# EAGLE design TR_i3_6A_Module_v11 (EAGLE 9.6.2)

## Sheet 1 of 2
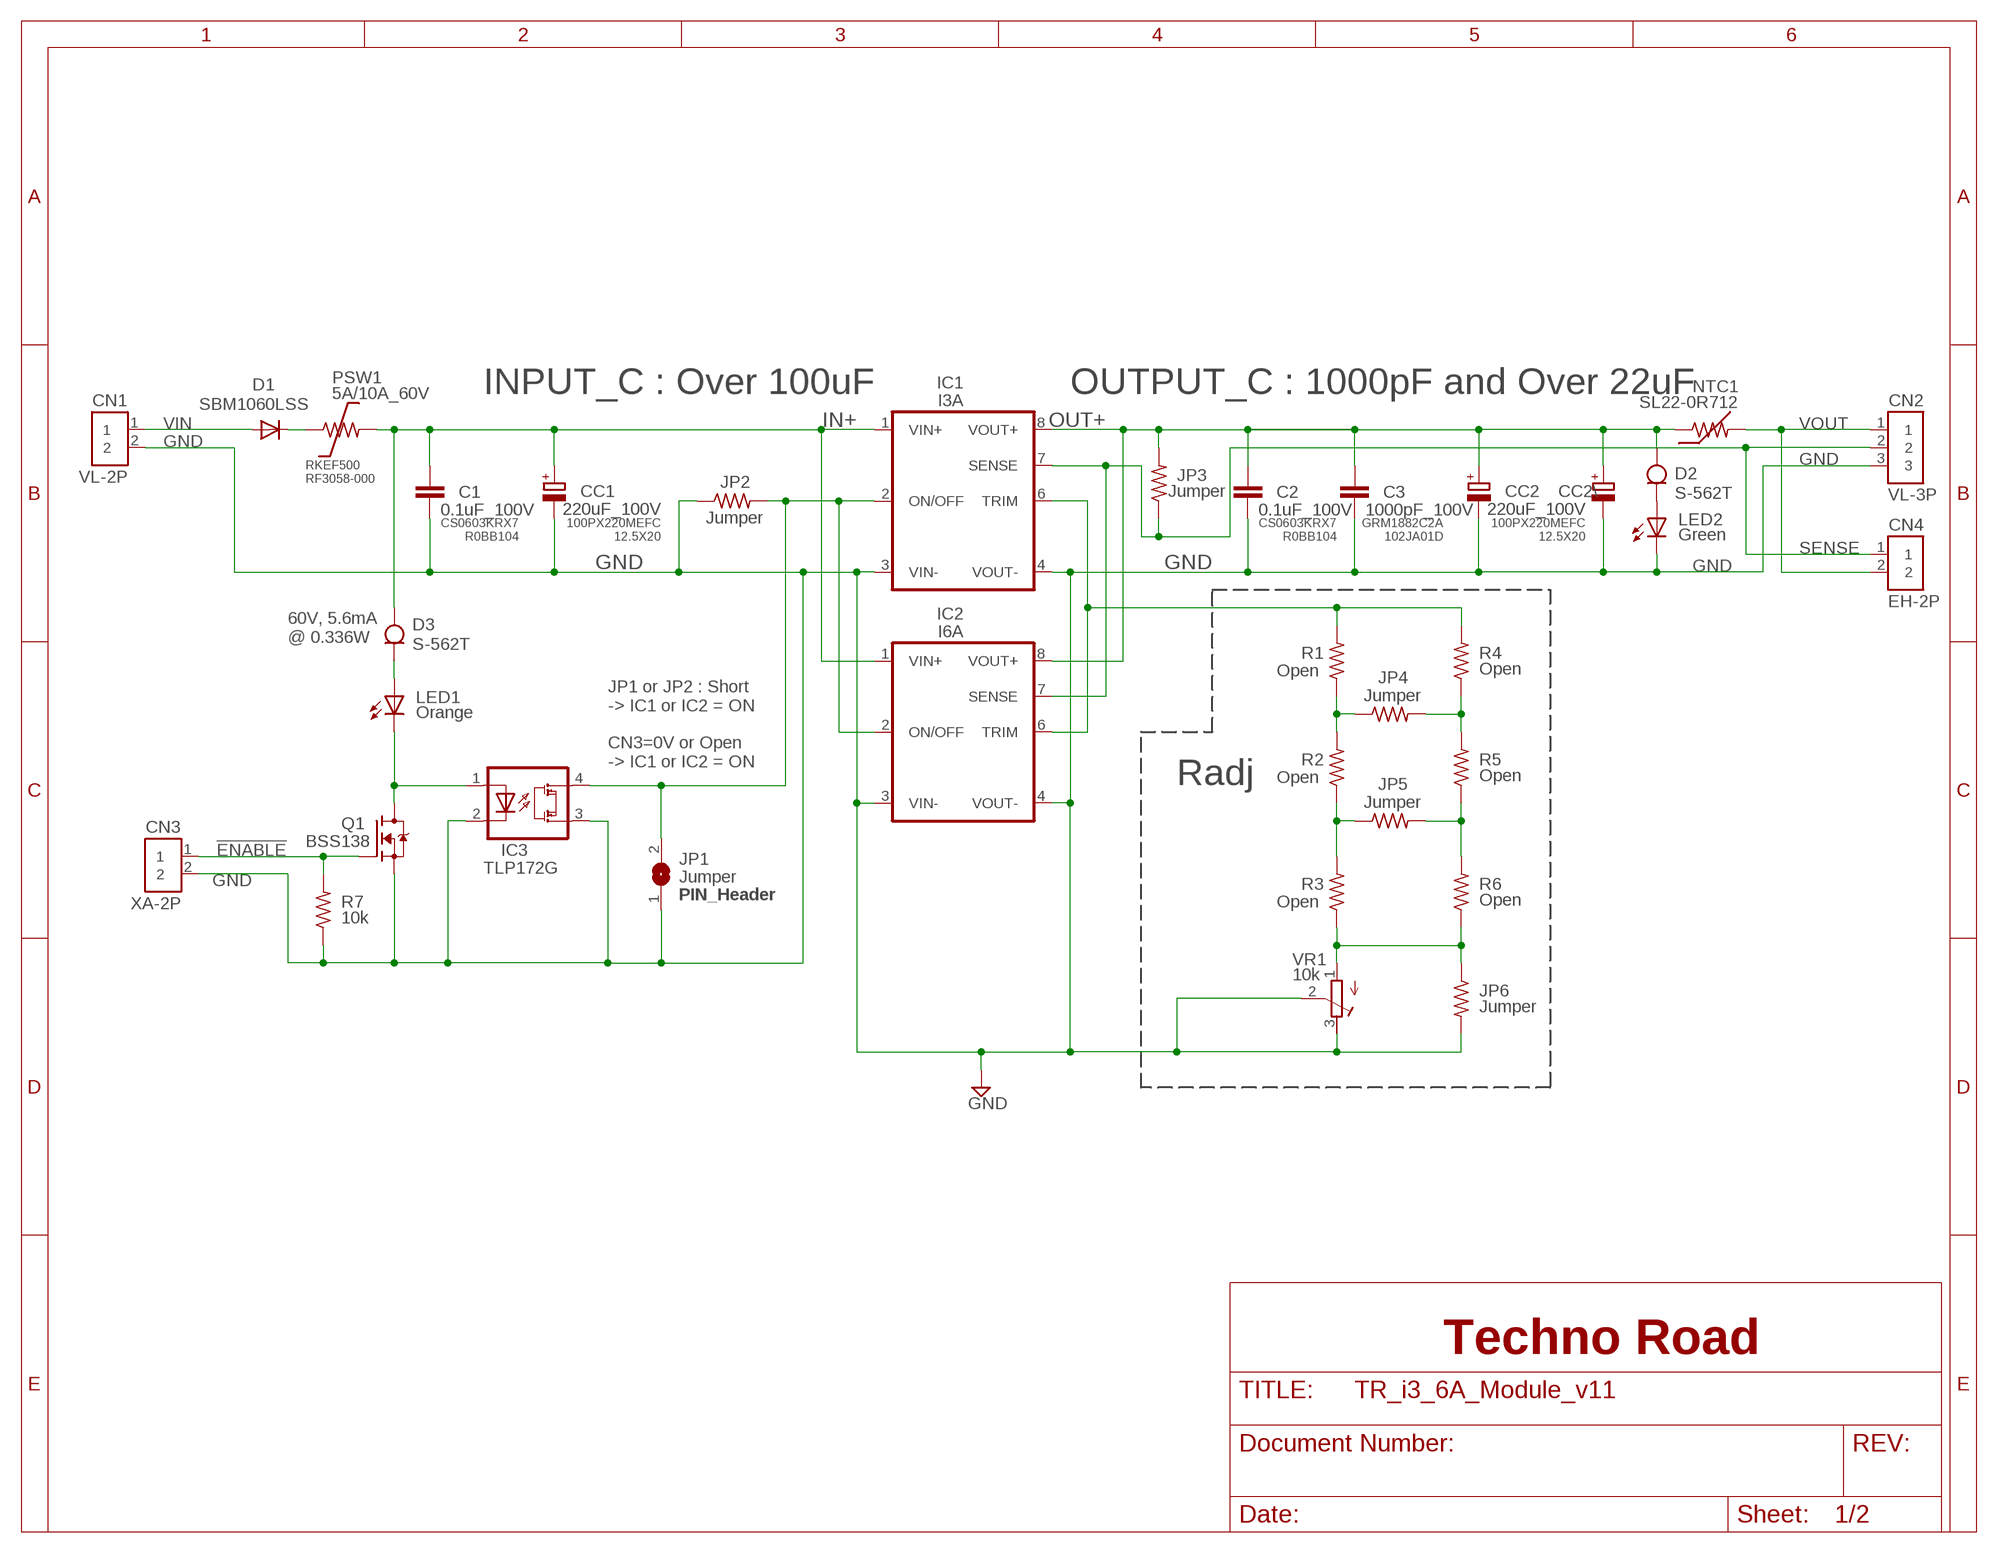
[diagram p0: schematic, sheet 1]

### Parts
C1  0.1uF_100V  C1608  [C1608]
C2  0.1uF_100V  C1608  [C1608]
C3  1000pF_100V  C1608  [C1608]
CC1  220uF_100V  CC0510  [CC0510]
CC2  220uF_100V  CC0510  [CC0510]
CC2\  CPOL-EUE7.5-16  [E7,5-16]
CN1  VL-2P  2PVL3  [VL3-2P]
CN2  VL-3P  3PVL3  [VL3-3P]
CN3  XA-2P  2PXA_NH  [XA-2P_NH]
CN4  EH-2P  2PEH  [EH-2P]
D1  SBM1060LSS  D12.7  [12.7MM]
D2  S-562T  CRDS-XXXT  [S-XXXT]
D3  S-562T  CRDS-XXXT  [S-XXXT]
IC1  I3A  I3A/I6A_SEREISI3A  [I3A_SERIES]
IC2  I6A  I3A/I6A_SEREISI6A  [I6A_SERIES]
IC3  TLP172G  TLP172  [11-5H1]
JP1  Jumper  JP1D  [JP1D_HOLE]
JP2  Jumper  R1608_LARGE_PAD  [R1608_LARGE_PAD]
JP3  Jumper  R1608_LARGE_PAD  [R1608_LARGE_PAD]
JP4  Jumper  R1608_LARGE_PAD  [R1608_LARGE_PAD]
JP5  Jumper  R1608_LARGE_PAD  [R1608_LARGE_PAD]
JP6  Jumper  R1608_LARGE_PAD  [R1608_LARGE_PAD]
LED1  Orange  LEDSML0603  [SML1608]
LED2  Green  LEDSML0603  [SML1608]
NTC1  SL22-0R712  NTCSL22  [SL22]
PSW1  5A/10A_60V  PSW10.16MM_4MM  [PSW-10.16MM_4MM]
Q1  BSS138  [SOT-23-3]
R1  Open  R1608_LARGE_PAD  [R1608_LARGE_PAD]
R2  Open  R1608_LARGE_PAD  [R1608_LARGE_PAD]
R3  Open  R1608_LARGE_PAD  [R1608_LARGE_PAD]
R4  Open  R1608_LARGE_PAD  [R1608_LARGE_PAD]
R5  Open  R1608_LARGE_PAD  [R1608_LARGE_PAD]
R6  Open  R1608_LARGE_PAD  [R1608_LARGE_PAD]
R7  10k  R1608_LARGE_PAD  [R1608_LARGE_PAD]
VR1  10k  R-TRIM3361P  [3361P]

### Nets
!ENABLE: CN3.1 Q1.1(G) R7.2
D_PSW: D1.2(C) PSW1.1
GND: C1.2 C2.2 C3.2 CC1.- CC2.- CC2\.- CN1.2 CN2.3 CN3.2 IC1.3(VIN-) IC1.4(VOUT-) IC2.3(VIN-) IC2.4(VOUT-) IC3.2(C1) IC3.3(DRN1) JP1.1 JP2.1 JP6.2 LED2.C Q1.2(S) R7.1 VR1.2(S) VR1.3(E)
IN+: C1.1 CC1.+ D3.A IC1.1(VIN+) IC2.1(VIN+) PSW1.2
N$1: JP6.1 R3.1 R6.1 VR1.1(A)
N$2: JP4.1 R1.1 R2.2
N$3: JP5.1 R2.1 R3.2
N$4: IC1.2(ON/OFF) IC2.2(ON/OFF) IC3.4(DRN2) JP1.2 JP2.2
N$5: D2.C LED2.A
N$6: D3.C LED1.A
N$7: IC1.6(TRIM) IC2.6(TRIM) R1.2 R4.2
N$8: JP4.2 R4.1 R5.2
N$9: JP5.2 R5.1 R6.2
N$10: IC3.1(A1) LED1.C Q1.3(D)
OUT+: C2.1 C3.1 CC2.+ CC2\.+ D2.A IC1.8(VOUT+) IC2.8(VOUT+) JP3.2 NTC1.1
SENSE: CN2.2 CN4.1 IC1.7(SENSE) IC2.7(SENSE) JP3.1
VIN: CN1.1 D1.1(A)
VOUT: CN2.1 CN4.2 NTC1.2

### Notes on the sheet
- INPUT_C : Over 100uF | OUTPUT_C : 1000pF and Over 22uF
- RKEF500
  RF3058-000
- CS0603KRX7
  R0BB104
- 100PX220MEFC
  12.5X20
- CS0603KRX7
  R0BB104
- GRM1882C2A
  102JA01D
- 100PX220MEFC
  12.5X20
- 60V, 5.6mA
  @ 0.336W
- JP1 or JP2 : Short
  -> IC1 or IC2 = ON
  
  CN3=0V or Open
  -> IC1 or IC2 = ON
- Radj
- PIN_Header
- Techno Road

## Sheet 2 of 2

## Library data of the parts
C1-C3 = my_rcl:C
CC1 CC2 = my_rcl:CC
CC2\ = rcl:CPOL-EU: POLARIZED CAPACITOR, European symbol
CN1 CN3 CN4 = my_con:2P
CN2 = my_con:3P
D1 = my_diode:D
D2 D3 = my_diode:CRD
IC1 IC2 = my_reg:I3A/I6A_SEREIS
IC3 = Original_Library:TLP172
JP1 = my_jumper:JP1D
JP2-JP6 R1-R7 = my_rcl:R
LED1 LED2 = my_led:LED
NTC1 = Original_Library:NTC
PSW1 = Original_Library:PSW
Q1 = my_tr:BSS138
VR1 = my_rcl:R-TRIM

## Board
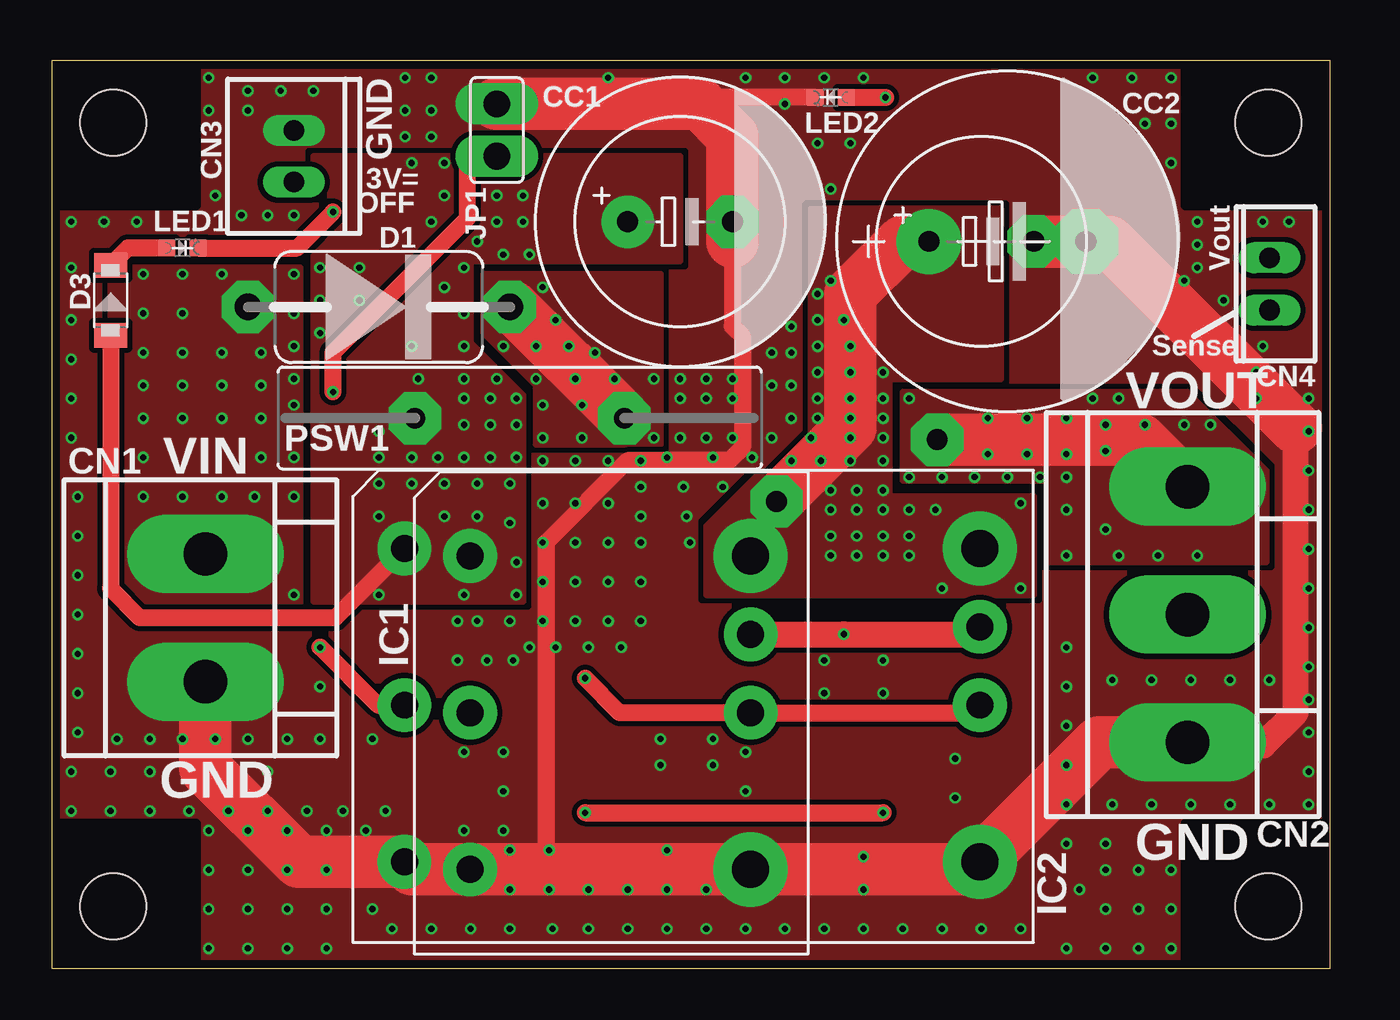
[diagram p1: board, top side]
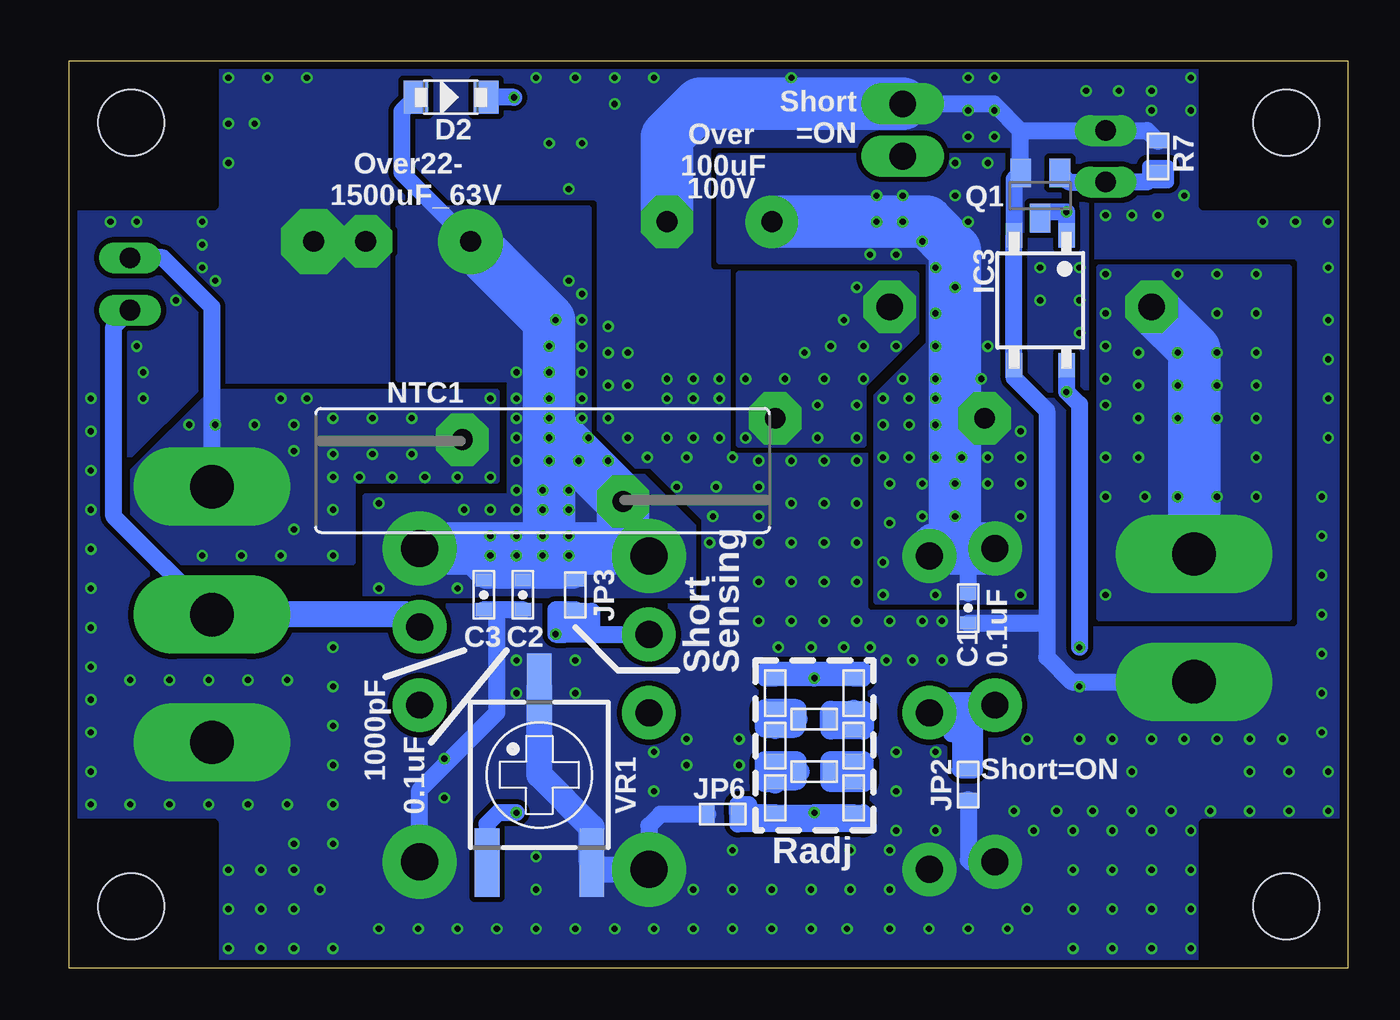
[diagram p2: board, bottom side, seen from below]

Size 62 x 44 mm. Coordinates in mm from the lower left corner, seen from the top.
Outline: 0,0 62,0 62,44 0,44 0,0
Copper layers (1*16): Top 0.035mm / dielectric 1.5mm / Bottom 0.035mm
Design rules "forSmallBoard_20221215_70um": minimum track width 0.2mm, minimum drill 0.3mm, track to track 0.2mm, track to pad 0.2mm, pad to pad 0.2mm, via to via 0.2mm, smd to smd 0mil, copper to edge 0.4mm, drill to drill 6mil, minimum pad ring 10mil, minimum via ring 5mil, stop-mask expansion 4mil, vias tented up to drill 0.5mm, thermal gap 10mil
Holes 3.2 mm at 3,3 59,3 59,41 3,41
tRestrict: area -1,37 to 7,45; area -1,-1 to 7,7; area 55,-1 to 63,7; area 55,37 to 63,45
bRestrict: area -1,37 to 7,45; area 55,37 to 63,45; area 55,-1 to 63,7; area -1,-1 to 7,7

### Footprints (pad centres in the part's own frame; a part is rotated, then mirrored left to right if it is on the bottom)
C1608 = smd 0.65 x 0.8: 1 -0.725,0; 2 0.725,0
CC0510 = drill 1.016 pad 2.54: + -2.54,0 | drill 1.016 pad 2.54 octagon: - 2.54,0
E7,5-16 = drill 1.016 pad 3.15: + -3.81,0 | drill 1.016 pad 3.15 octagon: - 3.81,0
VL3-2P = drill 2.1 pad 3.81 long: 1 -3.1,0; 2 3.1,0
VL3-3P = drill 2.1 pad 3.81 long: 1 -6.2,0; 2 0,0; 3 6.2,0
XA-2P_NH = drill 1 long: 1 1.25,0; 2 -1.25,0
EH-2P = drill 1 long: 1 -1.27,0; 2 1.27,0
12.7MM = drill 1.3 pad 2.54 octagon: 1 -6.35,0; 2 6.35,0
S-XXXT = smd 1.2 x 1.6: A 1.7,0; C -1.7,0
I3A_SERIES = drill 1.3 pad 2.6: 1 -6.85,7.6; 2 -6.85,0; 3 -6.85,-7.6; 6 6.75,0; 7 6.75,3.8 | drill 1.8 pad 3.6: 4 6.75,-7.6; 8 6.75,7.6
I6A_SERIES = drill 1.3 pad 2.6: 1 -14,7.65; 2 -14,0.05; 3 -14,-7.55; 6 13.9,0.05; 7 13.9,3.85 | drill 1.8 pad 3.6: 4 13.9,-7.55; 8 13.9,7.65
11-5H1 = smd 0.8 x 1.2: 1 -1.27,-3.15; 2 1.27,-3.15; 3 1.27,3.15; 4 -1.27,3.15
JP1D_HOLE = drill 1.3 pad 2 long: 1 -1.27,0; 2 1.27,0
R1608_LARGE_PAD = smd 0.65 x 0.9: 1 -0.725,0; 2 0.725,0
SML1608 = smd 0.8 x 0.8: A 0.75,0; C -0.75,0
SL22 = drill 1 pad 2.54 octagon: 1 -3.9,1.5; 2 3.9,-1.5
PSW-10.16MM_4MM = drill 1 pad 2.54 octagon: 1 -5.08,0; 2 5.08,0
SOT-23-3 = smd 1 x 1.4: 1 -0.95,-1.1; 2 0.95,-1.1; 3 0,1.1
3361P = smd 1.2 x 3.3: 1 -2.54,-4.25; 2 0,4.25; 3 2.54,-4.25

### Placement (x,y rotation side)
C1  18.41,17.46 270 bottom
C2  40.01,18.1 270 bottom
C3  41.91,18.1 270 bottom
CC1  30.48,36.2 0 top
CC2  45.09,35.24 0 top
CC2\  46.35,35.24 0 top
CN1  7.46,16.99 270 top
CN2  55.09,17.14 270 top
CN3  11.75,39.37 270 top
CN4  59.05,33.18 90 top
D1  15.88,32.07 0 top
D2  43.5,42.23 180 bottom
D3  2.86,32.38 270 top
IC1  27.15,12.38 0 top
IC2  31.11,12.7 0 top
IC3  14.92,32.38 180 bottom
JP1  21.59,40.64 270 top
JP2  18.41,8.89 90 bottom
JP3  37.47,18.1 90 bottom
JP4  25.88,12.06 0 bottom
JP5  25.88,9.53 0 bottom
JP6  30.32,7.46 180 bottom
LED1  6.35,34.92 180 top
LED2  37.78,42.23 0 top
NTC1  39.05,24.13 180 bottom
PSW1  22.7,26.67 180 top
Q1  14.92,37.47 180 bottom
R1  27.78,13.34 90 bottom
R2  27.78,10.79 90 bottom
R3  27.78,8.26 90 bottom
R4  23.97,13.34 90 bottom
R5  23.97,10.79 90 bottom
R6  23.97,8.26 90 bottom
R7  9.21,39.37 270 bottom
VR1  39.21,9.37 0 bottom

### Tracks (layer width: path | path; a pad name or v marks a point on that pad's centre or on a via)
!ENABLE
  Bottom 0.61: 9.21,38.89 R7.2 9.37,38.49 9.68,38.49 9.68,38.89 9.21,38.89 | 9.21,38.89 8.73,38.89 8.73,38.12 9.73,38.12
  Bottom 0.813: Q1.1 13.53,38.12 CN3.1 9.73,38.12
D_PSW  (via drill 0.3 pad 0.55)
  Top 2.54: PSW1.1 22.38,32.07 D1.2
  other vias: 25.4,28.57 29.21,28.57 23.5,28.57 23.5,30.16 23.81,27.3 21.91,30.16 27.3,28.57 25.08,30.16 24.45,31.43 25.72,27.3 23.81,25.72 25.72,25.72 29.21,25.72 26.35,29.84 23.81,33.02
  pour Bottom (isolate 0.254, no thermals): 20.95,33.66 29.53,33.66 29.53,25.4 23.5,25.4 23.5,28.26 20.95,30.8
  pour Top (isolate 0.254, no thermals): 20.95,33.66 20.95,30.8 23.5,28.26 23.5,25.4 29.53,25.4 29.53,33.66
GND  (via drill 0.3 pad 0.55)
  Top 0.813: JP1.1 20.95,42.55 | CC1.- 33.02,31.11 33.5,30.64 33.5,25.24 32.86,24.61 27.94,24.61 23.97,20.64 23.97,4.94 23.81,4.78 | LED2.C 31.75,42.23 31.43,41.91
  Top 1.27: CN2.3 55.24,10.79 58.74,10.79 60.33,12.38 60.33,26.19
  Top 2.54: 33.02,35.24 CC1.- 33.02,40.32 31.43,41.91 JP1.1 | CN2.3 50.81,10.95 IC2.4 44.65,4.78 IC1.4 23.81,4.78 IC1.3 17.48,4.78 IC2.3 11.99,5.15 7.46,9.68 CN1.2 | 60.33,26.19 51.28,35.24 CC2\.- CC2.-
  Bottom 0.813: 15.87,40.62 Q1.2 16.19,38.24 IC3.2 IC3.3 16.19,28.63 14.6,27.04 14.6,16.74 | 15.87,40.62 CN3.2 9.73,40.62 R7.1 | JP1.1 17.16,41.91 15.87,40.62 | C2.2 41.27,17.37 | 41.27,17.37 C3.2 | IC2.4 45.02,8.64 41.27,12.38 41.27,17.37 | JP2.1 18.41,5.24 18.33,5.15 IC2.3 | C1.2 14.6,16.74 | JP6.2 33.34,7.46 33.9,6.9 IC1.4 | 14.6,16.74 14.6,15.08 13.41,13.89 CN1.2
  Bottom 1.27: VR1.2 39.21,9.37 36.67,6.83 VR1.3 36.34,4.78 IC1.4
  Bottom 2.54: JP1.1 31.43,41.91 33.02,40.32 CC1.-
  other vias: 0.95,7.62 13.02,13.65 1.27,15.24 2.86,7.62 6.67,7.62 10.48,9.53 12.38,7.62 0.95,9.53 1.27,17.14 1.27,19.05 0.95,36.2 8.57,7.62 7.62,0.95 7.62,2.86 10.48,7.62 9.53,6.67 9.53,4.76 15.56,11.11 16.19,7.62 14.13,7.62 9.53,2.86 9.53,0.95 16.51,1.91 18.41,1.91 20.32,1.91 24.29,1.91 22.23,1.91 31.75,1.91 26.04,1.91 27.94,1.91 33.66,1.91 35.56,1.91 29.84,1.91 39.37,1.91 41.27,1.91 43.18,1.91 37.47,1.91 45.09,1.91 46.99,1.91 49.21,0.95 54.29,0.95 54.29,2.86 54.29,4.76 51.12,4.76 51.12,6.03 49.21,6.03 4.13,36.2 0.95,33.97 0.95,31.43 1.27,22.86 1.27,20.95 11.75,36.51 9.53,42.55 11.11,42.55 18.41,43.18 35.56,43.18 37.15,40.01 52.39,43.18 54.29,43.18 53.02,40.96 55.56,36.2 58.42,28.89 60.96,20.32 60.96,18.41 60.96,16.51 60.96,14.61 60.96,13.02 49.21,13.65 49.21,11.75 49.21,9.84 49.21,15.56 51.44,13.97 33.02,25.72 30.64,23.34 32.54,23.34 28.57,23.34 26.99,22.54 25.4,22.54 23.81,22.54 23.81,20.64 7.62,6.67 7.62,4.76 29.53,11.11 32.07,11.11 33.66,10.48 37.47,13.34 40.32,13.34 43.81,8.26 43.81,10.16 33.02,28.57 31.75,28.57 31.75,25.72 34.92,25.72 35.88,31.11 30.48,28.57 30.48,25.72 34.92,28.26 35.88,26.67 13.02,11.11 35.88,29.84 34.92,29.84 35.56,41.91 33.66,43.18 54.29,40.96 54.29,39.05 55.56,35.08 55.56,33.97 60.01,36.2 58.74,36.2 58.42,27.62 58.74,30.16 26.99,43.18 54.93,33.34 50.48,43.18 35.88,28.26 38.73,40.01 2.54,36.2 10.48,36.51 9.21,36.51 7.94,37.47 7.62,43.18 7.62,41.59 12.7,42.55 9.53,41.59 17.14,43.18 17.14,41.59 17.14,40.32 18.41,41.59 18.41,40.32 60.96,27.62 60.96,26.04 60.96,24.13 60.96,22.23 60.96,11.43 60.96,9.53 60.96,7.94 59.05,13.97 57.15,13.97 55.24,13.97 53.34,13.97 59.05,7.94 57.15,7.94 55.24,7.94 53.34,7.94 51.44,7.94 49.21,7.94 52.7,2.86 51.12,2.86 52.7,4.76 52.7,0.95 51.12,0.95 49.85,3.81 39.37,3.81 39.37,5.4 33.97,24.77 32.07,24.77 29.84,24.77 28.57,24.61 26.99,24.61 25.4,24.61 23.81,24.61 37.47,14.92 40.32,14.92 25.4,20.64 26.99,20.64 28.57,20.64 30.96,20.64 23.81,18.73 25.4,18.73 26.99,18.73 28.57,18.73 28.57,16.83 26.99,16.83 25.4,16.83 23.81,16.83 27.62,15.56 22.23,16.83 20.64,16.83 19.68,16.83 19.68,14.92 21.11,14.92 22.38,14.92 26.04,15.56 24.45,15.56 23.18,15.56 29.53,9.84 32.07,9.84 33.66,8.57 0.95,29.53 0.95,27.62 0.95,25.72 1.27,13.34 1.27,11.43 2.86,9.53 4.76,9.53 4.76,7.62 15.56,2.86 11.43,0.95 13.34,0.95 11.43,2.86 11.43,4.76 11.43,6.67 13.34,6.67 13.34,4.76 13.34,2.86 15.24,6.67 21.91,10.48 21.91,8.57 21.91,6.67 20,6.67 20,10.48 22.23,3.81 22.23,5.71 24.13,5.71 24.13,3.81 26.04,3.81 27.94,3.81 29.84,3.81 29.84,5.71 31.75,3.81 37.78,37.78 37.47,43.18 39.37,43.18 56.83,32.38 11.43,11.11 3.17,11.11 4.76,11.11 6.35,11.11 7.94,11.11 9.53,11.11 30.48,27.62 31.75,27.62 33.02,27.62 28.57,21.91 30.8,21.91
  pour Top (isolate 0.254, rank 2, no thermals): 0,0 62.23,0 62.23,44.13 0,44.13
  pour Bottom (isolate 0.254, rank 2, no thermals): 0,0 62.23,0 62.23,44.13 0,44.13
IN+  (via drill 0.3 pad 0.55)
  Top 0.813: D3.A 2.86,18.41 4.29,16.99 13.75,16.99 IC2.1
  Bottom 0.813: C1.1 18.41,19.71 19.05,20.35
  Bottom 2.54: 19.05,26.67 PSW1.2 | CC1.+ 20.41,36.2 19.05,34.83 19.05,26.67 | 19.05,26.67 19.05,20.35 | 19.05,20.35 IC2.1 | IC1.1 19.93,20.35 19.05,20.35
  other vias: 19.05,23.5 15.88,23.5 15.88,18.1 22.54,18.1 22.23,21.59 17.46,23.5 20,31.75 19.05,33.02 20,33.97 17.46,39.05 19.05,39.05 21.59,36.2 21.59,37.47 13.02,32.38 14.92,32.38 15.88,24.77 21.27,27.62 22.54,27.62 22.54,26.35 22.86,37.47 23.18,34.61 22.86,36.2 13.02,33.97 14.92,33.97 13.02,30.8 20,30.16 17.46,30.16 17.46,24.77 21.27,26.35 21.59,28.57 20,28.57 20,27.62 20,26.35 17.78,28.57 15.88,26.04 20.64,23.5 22.23,23.5 20.64,21.91 19.05,21.91 15.88,21.91 20,18.1 22.54,19.68 19.05,37.47 18.41,36.2 21.91,34.61 20.64,35.24 22.54,24.77 21.27,24.77 20,24.77 18.73,24.77
  pour Bottom (isolate 0.254, no thermals): 12.7,39.37 12.7,17.78 22.86,17.78 22.86,27.74 20.32,30.28 20.32,34.29 30.48,34.29 30.48,39.37
  pour Top (isolate 0.254, no thermals): 12.7,39.37 12.7,17.78 22.86,17.78 22.86,27.8 20.32,30.34 20.32,34.29 30.48,34.29 30.48,39.37
N$1  (via drill 0.3 pad 0.55)
  Top 0.813: v25.88,7.53 v40.32,7.53
  Bottom 0.2: 29.58,7.46 29.59,7.46 JP6.1
  Bottom 0.813: v40.32,7.53 41.21,7.53 41.75,6.99 VR1.1 | 29.05,7.53 R3.1 v25.88,7.53 R6.1 23.5,7.53 23.5,6.99 29.59,6.99 29.59,7.46 | 29.05,7.53 29.5,7.53 29.58,7.46 | JP6.1 29.6,7.93 29.05,7.93 29.05,7.53
N$2
  Bottom 0.813: R1.1 27.78,12.06 | 27.78,12.06 R2.2 | 27.78,12.06 26.83,12.06 JP4.1 26.76,12.06 | 27.94,11.68 R2.2 | R2.2 27.62,11.68
  Bottom 1.016: 26.76,12.06 26.76,12.54 28.26,12.54 28.26,11.68 27.94,11.68 | 27.62,11.68 26.83,11.68 26.83,12.06
N$3
  Bottom 0.813: R2.1 27.78,9.53 | 27.78,9.53 27.78,9.05 R3.2 | JP5.1 27.78,9.53
  Bottom 1.016: 27.78,9.05 28.26,9.05 28.26,10 26.76,10 26.76,9.68 JP5.1 26.76,9.37 26.76,9.14 27.62,9.14 R3.2
N$4  (via drill 0.3 pad 0.55)
  Top 0.813: v13.65,27.94 13.65,29.84 20.16,36.35 20.16,39.37 JP1.2 | v13.02,15.56 13.04,15.56 15.85,12.75 IC2.2
  Bottom 0.813: v13.65,27.94 IC3.4 13.65,27.96 13.02,27.33 v13.02,15.56 | JP2.2 18.41,12.59 18.57,12.75 | JP2.2 18.1,9.62 18.1,11.91 19.21,11.91 19.21,11.36 18.8,11.36 18.8,9.62 JP2.2
  Bottom 1.27: IC1.2 19.93,12.75 18.57,12.75 IC2.2
N$5  (via drill 0.3 pad 0.55)
  Top 0.813: LED2.A v40.44,42.23
  Bottom 0.813: v40.44,42.23 D2.C
N$6
  Top 0.813: LED1.A 3.7,34.92 D3.C
N$7  (via drill 0.3 pad 0.55)
  Top 0.813: v25.88,14.06 27.55,12.38 IC1.6 44.65,12.38 IC2.6
  Bottom 0.813: R4.2 23.5,14.06 23.5,14.45 28.26,14.45 28.26,14.06 R1.2 v25.88,14.06 R4.2
N$8
  Bottom 0.813: R4.1 23.97,12.06 | 23.97,12.06 R5.2 | JP4.2 23.97,12.06 | R4.1 23.81,12.45 | 24.13,12.45 R4.1
  Bottom 1.016: 23.81,12.45 23.5,12.45 23.5,11.59 25.08,11.59 25.08,12.45 24.13,12.45
N$9
  Bottom 0.813: R5.1 23.97,9.53 | 23.97,9.53 R6.2 | 23.97,9.53 JP5.2 | R6.2 23.9,9.05 | R6.2 24.04,9.05
  Bottom 1.016: 23.9,9.05 23.5,9.05 23.5,10 25.08,10 25.08,9.05 24.04,9.05
N$10  (via drill 0.3 pad 0.55)
  Top 0.813: v13.65,36.67 11.91,34.92 LED1.C
  Bottom 0.813: IC3.1 v13.65,36.67 14.62,36.67 Q1.3
OUT+  (via drill 0.3 pad 0.55)
  Top 0.61: 37.78,25.4 36.67,25.4 v35.88,24.61
  Top 2.54: NTC1.1 38.73,26.21 38.73,32.7 41.27,35.24 CC2.+
  Bottom 0.61: v35.88,24.61 35.88,23.36 NTC1.1
  Bottom 0.813: IC2.8 43.44,20.35 C3.1 C2.1 JP3.2 | 38.78,30.48 38.78,30.05 | D2.A 45.88,41.55 45.88,38.58 CC2.+
  Bottom 2.54: IC2.8 38.73,20.35 | 38.73,20.35 34.26,20.35 IC1.8 35.15,21.24 NTC1.1 38.73,26.21 | 38.73,20.35 38.73,26.21 | CC2.+ 38.73,31.43 38.73,26.21
  other vias: 40.32,20.95 40.32,27.62 39.05,20.95 38.73,27.62 37.78,20.95 37.15,27.62 38.73,30.16 37.78,33.34 37.15,28.89 37.15,32.7 40.32,28.89 38.73,28.89 37.15,30.16 38.42,31.43 37.15,31.43 36.83,25.72 38.73,25.72 40.32,25.72 37.31,24.61 38.73,24.61 40.32,24.61 40.32,23.18 39.05,23.18 37.78,23.18 37.78,22.23 39.05,22.23 40.32,22.23 41.59,22.23 42.86,22.23 46.99,22.54 46.99,18.41 43.18,18.41 41.59,20.95 41.59,20 40.32,20 39.05,20 37.78,20 37.15,26.67 38.73,26.67 40.32,26.67
  pour Bottom (isolate 0.254, no thermals): 36.83,23.81 36.83,36.83 46.04,36.83 46.04,28.57 40.64,28.57 40.64,22.86 47.62,22.86 47.62,18.1 31.75,18.1 31.75,21.43 34.13,23.81
  pour Top (isolate 0.254, no thermals): 36.83,23.81 34.13,23.81 31.75,21.43 31.75,18.1 47.62,18.1 47.62,22.86 40.64,22.86 40.64,28.57 46.04,28.57 46.04,36.83 36.83,36.83
SENSE  (via drill 0.3 pad 0.55)
  Top 0.813: 44.65,16.18 IC2.7 | v38.42,16.18 v38.42,16.19
  Top 1.27: IC1.7 v38.42,16.18 44.65,16.18
  Bottom 0.813: 36.67,16.18 IC1.7 | CN2.2 59.85,21.91 59.85,31.11 CN4.1 | 37.94,17.37 JP3.1 37.47,17.3 36.67,17.3 36.67,16.67 | 37.94,17.37 38.42,17.37 v38.42,16.19 37.94,16.19 | 36.67,16.67 36.67,16.19 | 36.83,16.18 36.67,16.18 | 36.67,16.18 36.67,16.19 | 37.94,16.19 37.94,16.67 | 37.94,16.67 37.94,17.37 | 36.67,16.19 37.94,16.19 | 37.94,16.67 36.67,16.67
  Bottom 1.27: IC2.7 45.61,17.14 CN2.2
VIN  (via drill 0.3 pad 0.55)
  Bottom 2.54: CN1.1 7.46,30 D1.1
  other vias: 6.35,33.66 4.45,33.66 4.45,29.84 6.35,29.84 8.26,29.84 4.45,28.26 4.45,24.77 4.45,26.67 11.75,31.75 11.75,33.66 10.16,29.84 10.16,24.77 8.26,33.66 4.45,31.75 6.35,31.75 6.35,28.26 6.35,26.67 8.26,26.67 8.26,28.26 10.16,28.26 10.16,26.67 11.75,24.77 11.75,28.57 11.75,30.16 11.75,27.3 4.45,22.86 6.35,22.86 8.26,22.86 9.84,22.86 11.75,22.86 11.75,18.1
  pour Top (isolate 0.254, no thermals): 2.86,33.97 12.06,33.97 12.06,16.99 2.86,16.99
  pour Bottom (isolate 0.254, no thermals): 2.86,33.97 2.86,16.99 12.06,16.99 12.06,33.97
VOUT  (via drill 0.3 pad 0.55)
  Top 2.54: NTC1.2 52.8,25.63 CN2.1
  Bottom 0.813: CN4.2 57.47,34.45 55.09,32.07 CN2.1
  other vias: 49.21,20 47.94,23.81 46.35,23.81 44.77,23.81 51.12,26.35 51.75,20 51.75,27.62 41.59,23.81 43.18,23.81 45.4,26.67 45.4,24.92 47.31,26.67 47.31,24.92 49.21,24.92 49.21,26.67 41.59,27.62 50.48,27.62 51.12,25.08 49.21,23.81 49.21,22.23 51.12,21.27 53.02,26.35 54.93,26.35 56.2,26.35 53.66,20 55.56,20
  pour Top (no thermals): 55.09,27.94 41.27,27.94 41.27,23.65 48.26,23.65 48.26,19.68 58.9,19.68 58.9,24.13
  pour Bottom (no thermals): 41.27,27.94 41.27,23.65 48.26,23.65 48.26,19.68 58.9,19.68 58.9,24.13 55.09,27.94

### Text on the board
tNames: GND | 3V= | OFF | Vout | Sense | VOUT | VIN | GND | GND
bNames: Short / =ON | Over / 100uF | 100V | Over22- / 1500uF_63V | 0.1uF | Sensing | Short | Short=ON | 1000pF | 0.1uF | Radj